# Altium schematic sheet Sheet.SchDoc: STM32_bluepill_uno
size B; Revision: 1.0
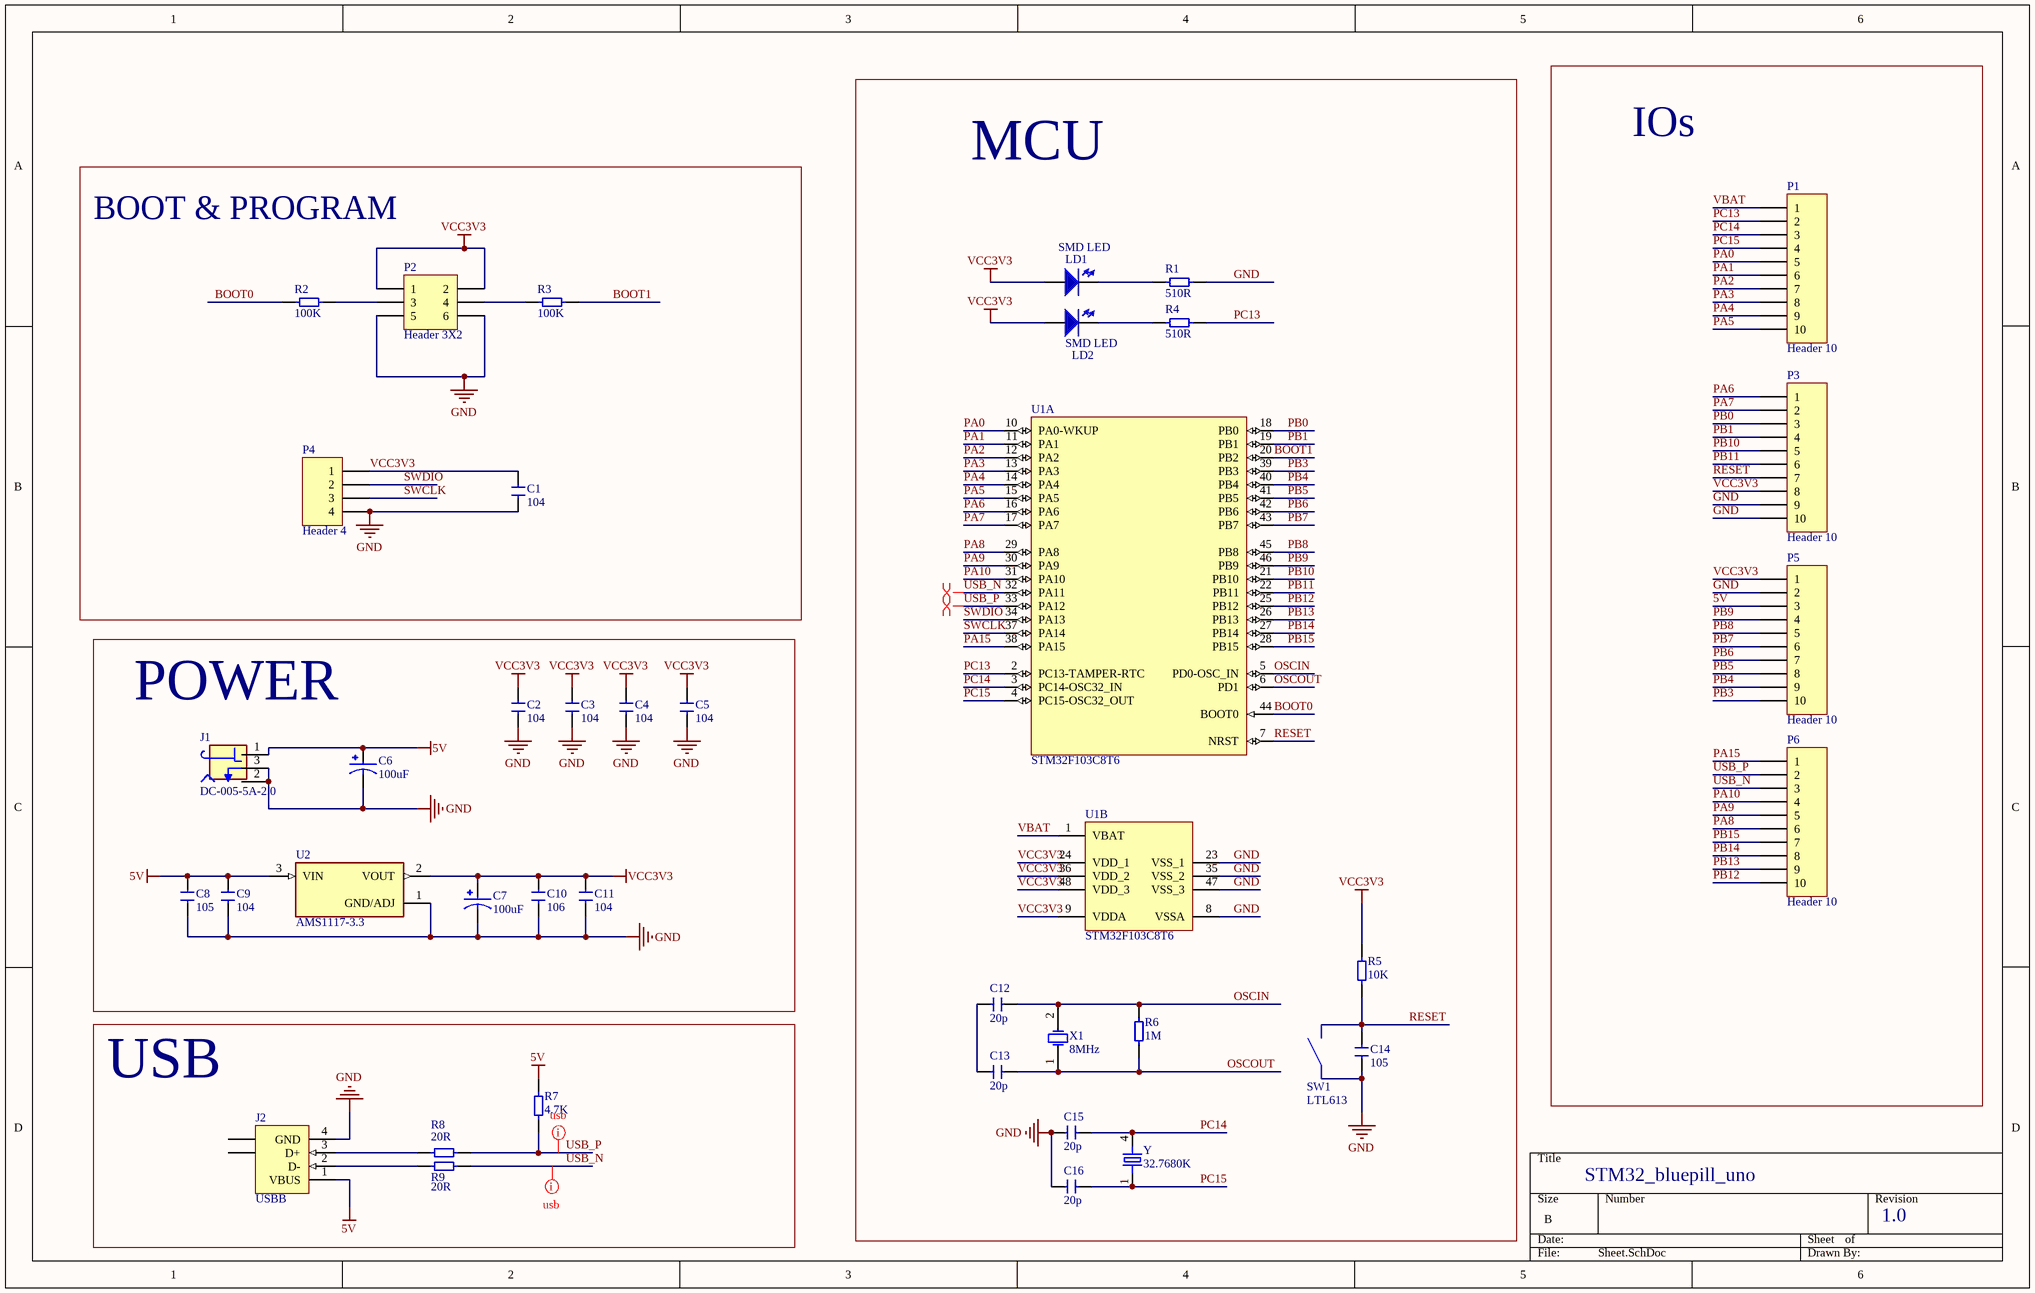
[diagram p0: Sheet.SchDoc]

## Parts
C1  Capacitor SMD  [0603 Capacitor]  (value not drawn)
C2  Capacitor SMD  [0603 Capacitor]  (value not drawn)
C3  Capacitor SMD  [0603 Capacitor]  (value not drawn)
C4  Capacitor SMD  [0603 Capacitor]  (value not drawn)
C5  Capacitor SMD  [0603 Capacitor]  (value not drawn)
C6  100uF  [CAP_50SVF10M]
C7  100uF  [CAP_50SVF10M]
C8  Capacitor SMD  [0603 Capacitor]  (value not drawn)
C9  Capacitor SMD  [0603 Capacitor]  (value not drawn)
C10  Capacitor SMD  [0603 Capacitor]  (value not drawn)
C11  Capacitor SMD  [0603 Capacitor]  (value not drawn)
C12  Capacitor SMD  [0603 Capacitor]  (value not drawn)
C13  Capacitor SMD  [0603 Capacitor]  (value not drawn)
C14  Capacitor SMD  [0603 Capacitor]  (value not drawn)
C15  Capacitor SMD  [0603 Capacitor]  (value not drawn)
C16  Capacitor SMD  [0603 Capacitor]  (value not drawn)
J1  DC-005-5A-2.0  [XKB_DC-005-5A-2.0]
J2  USBB  [USB]
LD1  SMD LED  [LED_1206 RED]
LD2  SMD LED  [LED_1206 RED]
P1  Header 10  [HDR1X10]
P2  Header 3X2  [HDR2X3]
P3  Header 10  [HDR1X10]
P4  Header 4  [HDR1X4]
P5  Header 10  [HDR1X10]
P6  Header 10  [HDR1X10]
R1  Resistor SMD  [0603 Resistor]  (value not drawn)
R2  Resistor SMD  [0603 Resistor]  (value not drawn)
R3  Resistor SMD  [0603 Resistor]  (value not drawn)
R4  Resistor SMD  [0603 Resistor]  (value not drawn)
R5  Resistor SMD  [0603 Resistor]  (value not drawn)
R6  Resistor SMD  [0603 Resistor]  (value not drawn)
R7  Resistor SMD  [0603 Resistor]  (value not drawn)
R8  Resistor SMD  [0603 Resistor]  (value not drawn)
R9  Resistor SMD  [0603 Resistor]  (value not drawn)
SW1  LTL613  [LTL613]
U1  STM32F103C8T6  [LQFP48_N]  (parts A,B of 2)
U2  AMS1117-3.3  [SOT229P700X180-4N]
X1  8MHz  [Xtal]
Y  32.7680K  [OSCL550P800X320X254-4N]

## Blocks framed on the sheet
IOs: P1 P3 P5 P6
MCU: C12-C16 LD1 LD2 R1 R4-R6 SW1 U1 X1 Y
BOOT & PROGRAM: C1 P2 P4 R2 R3
POWER: C2-C11 J1 U2
USB: J2 R7-R9

## Nets
5V: C6.1 C8.2 C9.2 J1.1 J2.1(VBUS) P5.3 R7.2 U2.3(VIN)
GND: C1.1 C2.1 C3.1 C4.1 C5.1 C6.2 C7.2 C8.1 C9.1 C10.1 C11.1 C14.1 C15.2 C16.2 J1.2 J1.3 J2.4(GND) P2.5 P2.6 P3.9 P3.10 P4.4 P5.2 R1.2 SW1.0 U1.8(VSSA) U1.23(VSS_1) U1.35(VSS_2) U1.47(VSS_3) U2.1(GND/ADJ)
VCC3V3: C1.2 C2.2 C3.2 C4.2 C5.2 C7.1 C10.2 C11.2 LD1.1(A) LD2.1(A) P2.1 P2.2 P3.8 P4.1 P5.1 R5.2 U1.9(VDDA) U1.24(VDD_1) U1.36(VDD_2) U1.48(VDD_3) U2.2(VOUT)
BOOT0: R2.1 U1.44(BOOT0)
BOOT1: R3.2 U1.20(PB2)
OSCIN: C12.1 R6.2 U1.5(PD0-OSC_IN) X1.2(OSC2)
OSCOUT: C13.1 R6.1 U1.6(PD1) X1.1(OSC1)
PA0: P1.5 U1.10(PA0-WKUP)
PA1: P1.6 U1.11(PA1)
PA2: P1.7 U1.12(PA2)
PA3: P1.8 U1.13(PA3)
PA4: P1.9 U1.14(PA4)
PA5: P1.10 U1.15(PA5)
PA6: P3.1 U1.16(PA6)
PA7: P3.2 U1.17(PA7)
PA8: P6.6 U1.29(PA8)
PA9: P6.5 U1.30(PA9)
PA10: P6.4 U1.31(PA10)
PA15: P6.1 U1.38(PA15)
PB0: P3.3 U1.18(PB0)
PB1: P3.4 U1.19(PB1)
PB3: P5.10 U1.39(PB3)
PB4: P5.9 U1.40(PB4)
PB5: P5.8 U1.41(PB5)
PB6: P5.7 U1.42(PB6)
PB7: P5.6 U1.43(PB7)
PB8: P5.5 U1.45(PB8)
PB9: P5.4 U1.46(PB9)
PB10: P3.5 U1.21(PB10)
PB11: P3.6 U1.22(PB11)
PB12: P6.10 U1.25(PB12)
PB13: P6.9 U1.26(PB13)
PB14: P6.8 U1.27(PB14)
PB15: P6.7 U1.28(PB15)
PC13: P1.2 R4.2 U1.2(PC13-TAMPER-RTC)
PC14: C15.1 P1.3 U1.3(PC14-OSC32_IN) Y.4
PC15: C16.1 P1.4 U1.4(PC15-OSC32_OUT) Y.1
RESET: C14.2 P3.7 R5.1 SW1.1 U1.7(NRST)
SWCLK: P4.3 U1.37(PA14)
SWDIO: P4.2 U1.34(PA13)
USB_N: P6.3 R9.2 U1.32(PA11)
USB_P: P6.2 R7.1 R8.2 U1.33(PA12)
VBAT: P1.1 U1.1(VBAT)
NetC12_2: C12.2 C13.2
NetJ2_2: J2.2(D-) R9.1
NetJ2_3: J2.3(D+) R8.1
NetLD1_2: LD1.2(K) R1.1
NetLD2_2: LD2.2(K) R4.1
NetP2_3: P2.3 R2.2
NetP2_4: P2.4 R3.1

Not connected (* = marked no-connect by the designer): J2 5(SHLD) 6(SHLD)

## Layout directives
differential pair: USB_N, USB_P

## Notes on the sheet
- STM32_bluepill_uno
- 1.0
- (in symbol Capacitor SMD) 105; 104; 106; 20p
- (in symbol Resistor SMD) 510R; 20R; 4.7K; 10K; 1M; 100K

## Library data of the parts
C6 C7 = 50SVF10M: 10F 50V Aluminum - Polymer Capacitors Radial, Can - SMD 40mOhm 1000 Hrs @ 125C; MF: Panasonic; SnapEDA_Link: https://www.snapeda.com/parts/50SVF10M/Panasonic/view-part/?ref=snap; Package: RADIAL-2 Panasonic; Value: *; MP: 50SVF10M; Check_prices: https://www.snapeda.com/parts/50SVF10M/Panasonic/view-part/?ref=eda
J1 = DC-005-5A-2.0: DC Power Receptacle Jack, Through Holeï¼ŒRight Angle; MF: XKB Industrial Precision; SnapEDA_Link: https://www.snapeda.com/parts/DC-005-5A-2.0/XKB+Connection/view-part/?ref=snap; Package: Package; Value: *; MP: DC-005-5A-2.0; Check_prices: https://www.snapeda.com/parts/DC-005-5A-2.0/XKB+Connection/view-part/?ref=eda
J2 = USBB: USB 1.1, Right Angle, Thru-Hole, Reverse Type, Receptacle, 4 Position, Black; ContactMaterial: Copper Alloy; ContactPlating: Gold Flash; TerminationLength: 2.40mm [0.094in.]; PCB_Layout: Complies with manufacturer's recommendation.; DrillSize: Corresponds to nominal value.; PanelGround: Without; Published: 15-Jul-2004; DatasheetDocument: 18-Mar-2004; PackageDocument: 18-Mar-2004; PackageReference: 440068; Publisher: Altium Limited; HousingMaterial: Glass-Filled Thermoplastic; ComponentLink1Description: Manufacturer Link; ComponentLink1URL: http://www.tycoelectronics.com/; ComponentLink2Description: Packaging Specification; ComponentLink2URL: http://ecommas.tycoelectronics.com/commerce/DocumentDelivery/DDEController?Action=showdoc&DocId=Customer+Drawing%7F440068%7FD%7Ftif%7FEnglish%7FC_440068_D.tif
LD1 LD2 = LED SMD
P1 P3 P5 P6 = Header 10: Header, 10-Pin; LatestRevisionDate: 17-Jul-2002; LatestRevisionNote: Re-released for DXP Platform.; Publisher: Altium Limited
P2 = Header 3X2: Header, 3-Pin, Dual row; LatestRevisionDate: 17-Jul-2002; LatestRevisionNote: Re-released for DXP Platform.; Publisher: Altium Limited
P4 = Header 4: Header, 4-Pin; LatestRevisionDate: 17-Jul-2002; LatestRevisionNote: Re-released for DXP Platform.; Publisher: Altium Limited
SW1 = Button_tact: Tact button switch
U1 = STM32F103C8T6: STM32 ARM-based 32-bit MCU Performance Line with 64 kB Flash, 20 kB Internal RAM, -40 to +85°C Temperature, 48-Pin LQFP, Tray; DatasheetVersion: rev13.0, Apr-2011; PackageVersion: rev13, Apr-2011; PackageReference: LQFP48; PackageDescription: 48-Pin Low-Profile Quad Flat Pack, 7 x 7 mm Body, 0.5 mm Pitch (LQFP48); ComponentLink1Description: Manufacturer URL; ComponentLink1URL: http://www.st.com/; ComponentLink2Description: STM32F103 Datasheet; ComponentLink2URL: http://www.st.com/internet/com/TECHNICAL_RESOURCES/TECHNICAL_LITERATURE/DATASHEET/CD00161566.pdf; ComponentLink3Description: STM32 Family Web Page; ComponentLink3URL: www.st.com/stm32
U2 = AMS1117-3.3: Sot223/Pkg 1-Amp 3.3-Volt Low Drop Out Voltage Regulatator; MF: Advanced Monolithic Systems; SnapEDA_Link: https://www.snapeda.com/parts/AMS1117-3.3/Advanced+Monolithic+Systems/view-part/?ref=snap; Package: SOT-223 Seeed Technology; Value: *; MP: AMS1117-3.3; Check_prices: https://www.snapeda.com/parts/AMS1117-3.3/Advanced+Monolithic+Systems/view-part/?ref=eda
X1 = Crystal
Y = MC-306_32.7680K-A5:_ROHS: 32.768kHz Â±100ppm Crystal 12.5pF 50 kOhms 4-SOJ, 5.50mm pitch; MP: MC-306 32.7680K-A5: ROHS; MF: EPSON; Price: None; Availability: Unavailable; Package: 4-4 Epson; SnapEDA_Link: https://www.snapeda.com/parts/MC-306%2032.7680K-A5%3A%20ROHS/EPSON/view-part/620500/?ref=snap; Value: *